# EAGLE design AGV (EAGLE 9.1.3)
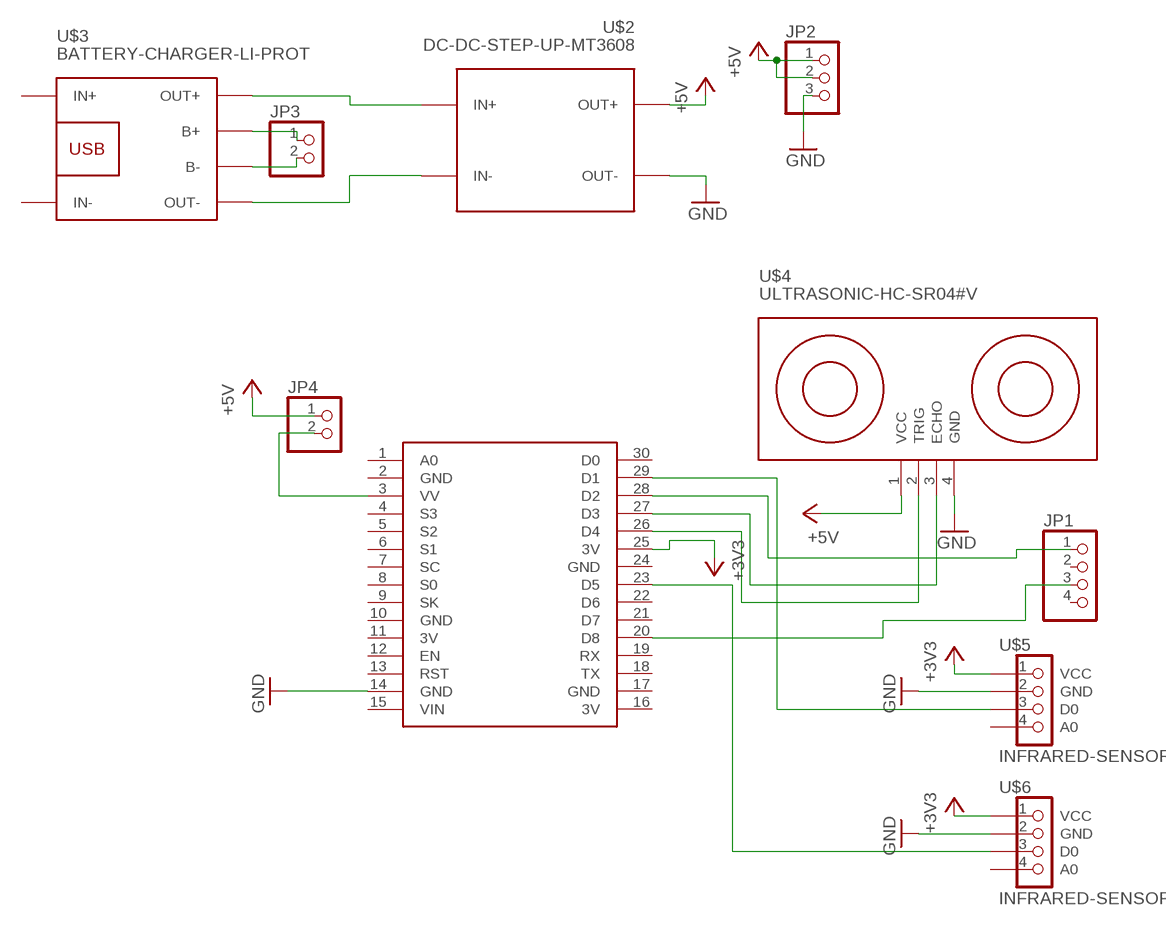
[diagram p0: schematic, sheet 1]

## Parts
JP1  PINHD-1X4  [1X04]
JP2  PINHD-1X3  [1X03]
JP3  PINHD-1X2  [1X02]
JP4  PINHD-1X2  [1X02]
U$1  NODEMCU  [NODEMCU]
U$2  DC-DC-STEP-UP-MT3608  [DC-DC-STEP-UP-MT3608]
U$3  BATTERY-CHARGER-LI-PROT  [BATTERY-CHARGER-LI-PROT]
U$4  ULTRASONIC-HC-SR04#V  [ULTRASONIC-HC-SR04#V]
U$5  INFRARED-SENSOR  [INFRARED-SENSOR]
U$6  INFRARED-SENSOR  [INFRARED-SENSOR]

## Nets
+3V3: U$1.25(3V) U$5.1(VCC) U$6.1(VCC)
+5V: JP2.1 JP2.2 JP4.1 U$2.OUT+ U$4.1(VCC)
GND: JP2.3 U$1.14(GND) U$2.OUT- U$4.4(GND) U$5.2(GND) U$6.2(GND)
N$1: JP3.1 U$3.B+
N$2: JP3.2 U$3.B-
N$3: U$2.IN+ U$3.OUT+
N$4: U$2.IN- U$3.OUT-
N$5: U$1.29(D1) U$5.3(D0)
N$6: JP1.1 U$1.28(D2)
N$7: U$1.27(D3) U$4.3(ECHO)
N$8: U$1.26(D4) U$4.2(TRIG)
N$9: JP4.2 U$1.3(VV)
N$10: U$1.23(D5) U$6.3(D0)
N$11: JP1.3 U$1.20(D8)
Unconnected: JP1.2 JP1.4 U$1.1(A0) U$1.4(S3) U$1.5(S2) U$1.6(S1) U$1.7(SC) U$1.8(S0) U$1.9(SK) U$1.12(EN) U$1.13(RST) U$1.15(VIN) U$1.18(TX) U$1.19(RX) U$1.21(D7) U$1.22(D6) U$1.30(D0) U$3.IN+ U$3.IN- U$5.4(A0) U$6.4(A0)

## Power pins joined to a net without a drawn wire
3V: U$1.11(3V) U$1.16(3V)
GND: U$1.2(GND) U$1.10(GND) U$1.17(GND) U$1.24(GND)

## Library data of the parts
JP1 = pinhead:PINHD-1X4: PIN HEADER
JP2 = pinhead:PINHD-1X3: PIN HEADER
JP3 JP4 = pinhead:PINHD-1X2: PIN HEADER
U$1 = MyLibrary:NODEMCU
U$2 = DIY Modules:DC-DC-STEP-UP-MT3608: DC/DC Step-Up Regulator based on MT3608 chip MT3608 datasheet available here: https://www.olimex.com/Products/Breadboarding/BB-PWR-3608/resources/MT3608.pdf Click here to find device on ebay.com <http://www.ebay.com/sch/mt3608+module>
U$3 = DIY Modules:BATTERY-CHARGER-LI-PROT: Lithium Battery 5V Charger with protection circuit More details available here: http://www.instructables.com/id/DIY-Lithium-ion-Battery-Charger/step4/TP4056-based-lithium-ion-battery-charger-module/ Click here to find device on ebay.com <http://www.ebay.com/sch/tp4056+charger+usb+protection>
U$4 = DIY Modules:ULTRASONIC-HC-SR04: Ultrasonic Ranging Module HC-SR04 More details available here: http://randomnerdtutorials.com/complete-guide-for-ultrasonic-sensor-hc-sr04/ Click here to find device on ebay.com <http://www.ebay.com/sch/hc+sr04+ultrasonic>
U$5 U$6 = MyLibrary:INFRARED-SENSOR

## Board
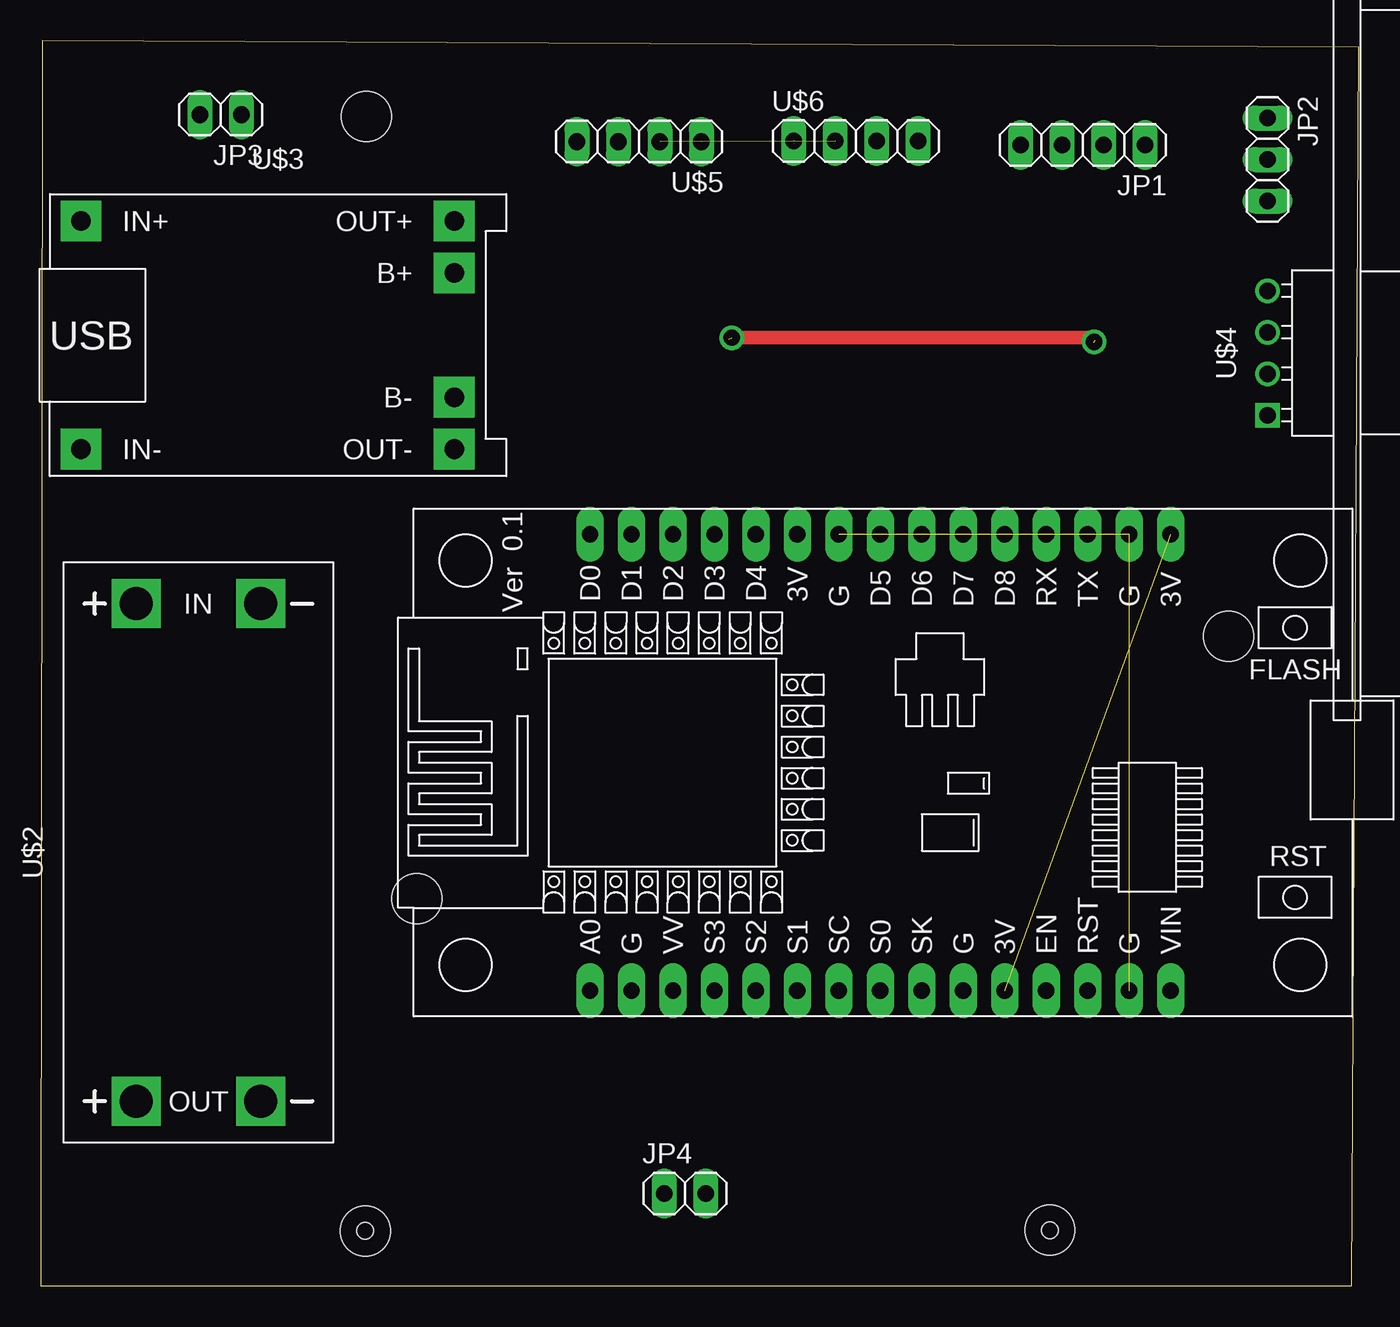
[diagram p1: board, top side]
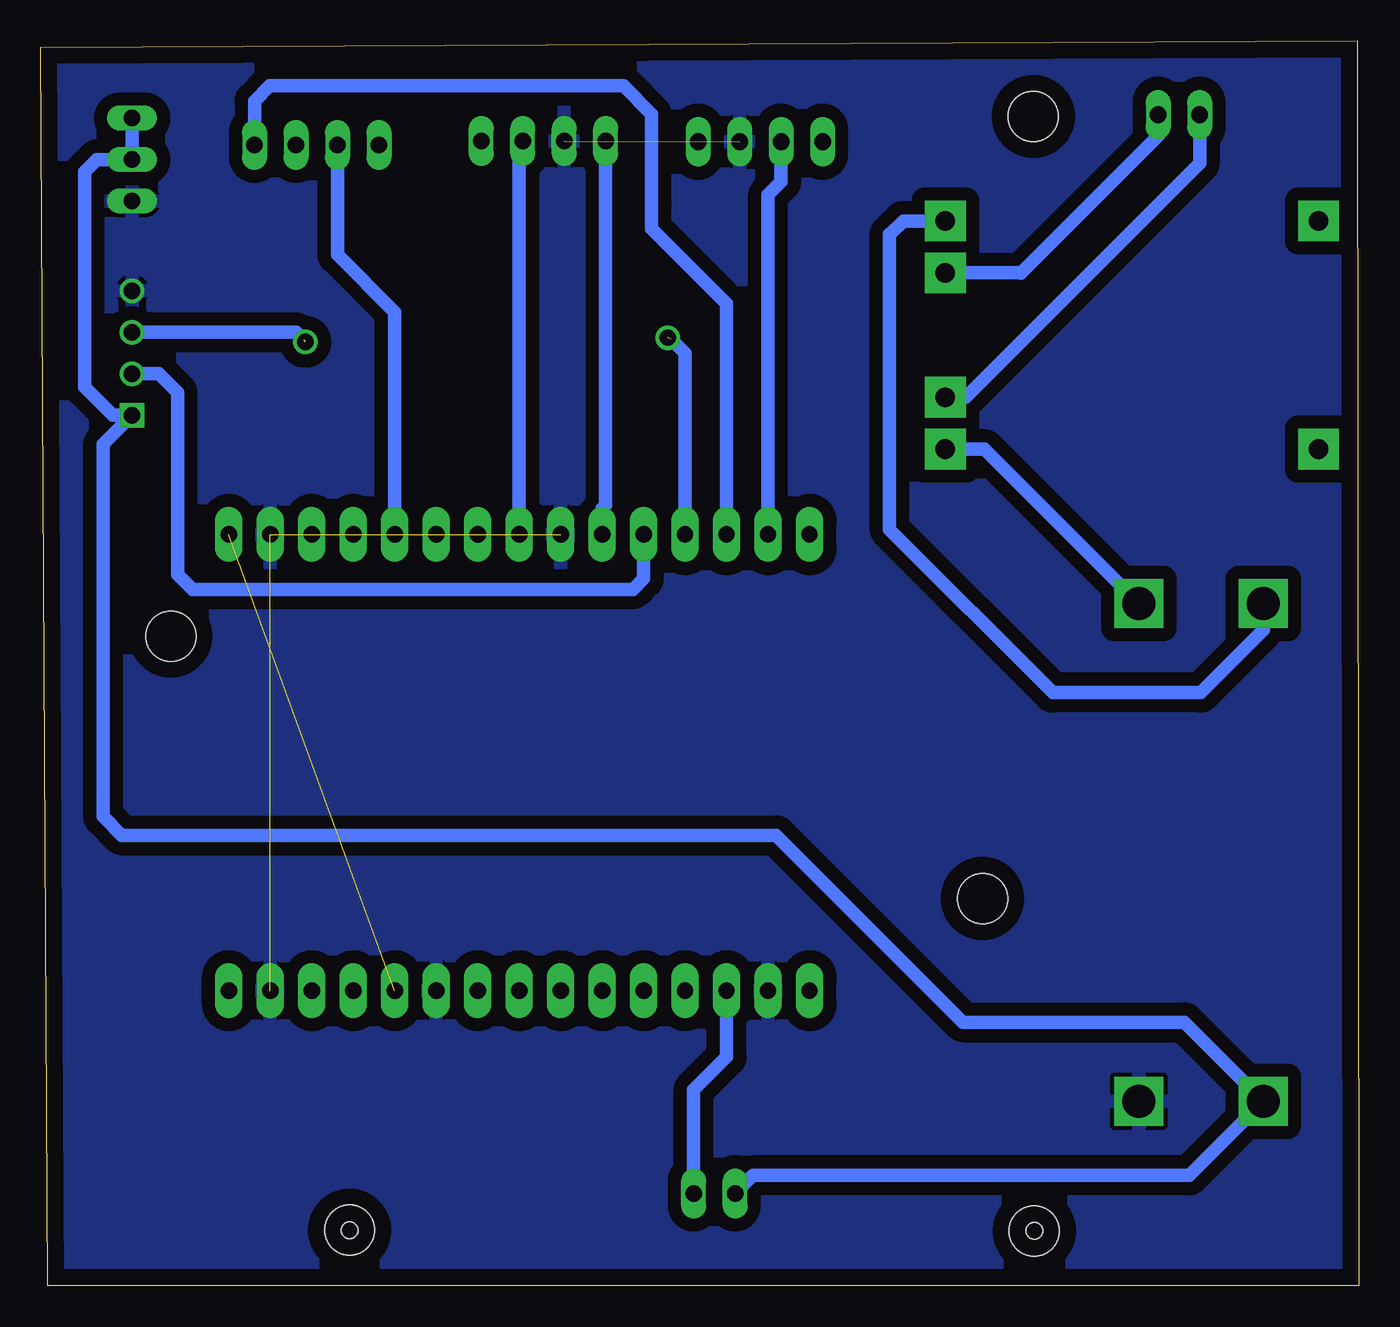
[diagram p2: board, bottom side, seen from below]

Size 80.7 x 76.25 mm. Coordinates in mm from the lower left corner, seen from the top.
Outline: 0,0 80.29,0.02 80.7,75.87 0.1,76.25 0,0
Copper layers (1*16): Top 0.035mm / dielectric 1.5mm / Bottom 0.035mm
Design rules "default": minimum track width 6mil, minimum drill 0.35mm, track to track 6mil, track to pad 6mil, pad to pad 6mil, via to via 6mil, smd to smd 6mil, copper to edge 40mil, drill to drill 6mil, minimum pad ring 10mil, minimum via ring 8mil, stop-mask expansion 4mil, vias tented up to drill 0mil, thermal gap 10mil
Holes 1 mm at 19.87,3.37 61.79,3.42
Holes 3.05 mm at 19.87,3.37 61.79,3.42 23.03,23.72 72.74,39.8 19.93,71.62

### Footprints (pad centres in the part's own frame; a part is rotated, then mirrored left to right if it is on the bottom)
1X04 = drill 1.016 long: 1 -3.81,0; 2 -1.27,0; 3 1.27,0; 4 3.81,0
1X03 = drill 1.016 long: 1 -2.54,0; 2 0,0; 3 2.54,0
1X02 = drill 1.016 long: 1 -1.27,0; 2 1.27,0
NODEMCU = drill 1 pad 1.676 long: 1 -13.97,19.05; 2 -13.97,16.51; 3 -13.97,13.97; 4 -13.97,11.43; 5 -13.97,8.89; 6 -13.97,6.35; 7 -13.97,3.81; 8 -13.97,1.27; 9 -13.97,-1.27; 10 -13.97,-3.81; 11 -13.97,-6.35; 12 -13.97,-8.89; 13 -13.97,-11.43; 14 -13.97,-13.97; 15 -13.97,-16.51; 16 13.97,-16.51; 17 13.97,-13.97; 18 13.97,-11.43; 19 13.97,-8.89; 20 13.97,-6.35; 21 13.97,-3.81; 22 13.97,-1.27; 23 13.97,1.27; 24 13.97,3.81; 25 13.97,6.35; 26 13.97,8.89; 27 13.97,11.43; 28 13.97,13.97; 29 13.97,16.51; 30 13.97,19.05
DC-DC-STEP-UP-MT3608 = drill 2 pad 2.8 square: IN+ 15.24,3.81; IN- 15.24,-3.81; OUT+ -15.24,3.81; OUT- -15.24,-3.81
BATTERY-CHARGER-LI-PROT = drill 1.2 pad 2.5 square: B+ 10.795,3.81; B- 10.795,-3.81; IN+ -12.065,6.985; IN- -12.065,-6.985; OUT+ 10.795,6.985; OUT- 10.795,-6.985
ULTRASONIC-HC-SR04#V = drill 1 square: 1 -3.81,0 | drill 1: 2 -1.27,0; 3 1.27,0; 4 3.81,0
INFRARED-SENSOR = drill 1.016 long: 1 -3.81,0; 2 -1.27,0; 3 1.27,0; 4 3.81,0

### Placement (x,y rotation side)
JP1  63.81,69.88 180 top
JP2  75.12,68.98 270 top
JP3  11,71.73 180 top
JP4  39.45,5.67 0 top
U$1  52.68,32.05 90 top
U$2  9.65,26.55 90 top
U$3  14.52,58.23 0 top
U$4  75.11,57.13 90 top
U$5  36.64,70.08 180 top
U$6  49.92,70.11 0 top

### Tracks (layer width: path | path; a pad name or v marks a point on that pad's centre or on a via)
3V  (1 unrouted)
+3V3  (1 unrouted)
  Bottom 0.813: U$1.25 46.33,47.6 46.11,47.82 U$6.1
+5V
  Bottom 0.813: JP2.1 JP2.2 77.27,68.98 78.02,68.23 78.02,55.04 76.3,53.32 U$4.1 76.89,51.55 76.89,28.74 75.74,27.59 35.67,27.59 24.23,16.15 10.68,16.15 U$2.OUT+ 10.38,6.77 37.08,6.77 JP4.1
GND  (3 unrouted)
  pour Bottom (isolate 0.813): -0.61,77.29 -0.32,77.57 83.06,77.57 83.06,-3.36 1.84,-3.36 -2.01,0.49 -2.01,75.84 -0.65,77.2 -0.79,77.34 -0.79,77.36 -0.76,77.38 -0.58,77.38
N$1
  Bottom 0.813: U$3.B+ 20.69,62.04 20.68,62.04 12.27,70.44 JP3.1
N$2
  Bottom 0.813: U$3.B- 24.07,54.42 9.73,68.75 JP3.2
N$3
  Bottom 0.813: U$3.OUT+ 27.88,65.22 28.7,64.4 28.73,64.4 28.73,46.34 18.74,36.34 9.68,36.34 5.84,40.18 U$2.IN+
N$4
  Bottom 0.813: U$2.IN- 22.92,51.25 U$3.OUT-
N$5
  Bottom 0.813: U$5.3 35.37,67.62 36.17,66.82 U$1.29
N$6
  Bottom 0.813: JP1.1 67.62,72.56 66.69,73.49 45.03,73.49 43.3,71.75 43.3,68.28 | 43.3,66.36 43.3,68.28 | U$1.28 38.71,60.15 43.3,64.74 43.3,68.28
N$7  (via drill 1)  (2 unrouted)
  Top 0.813: v42.31,58.07 64.24,58.07 v64.5,57.81
  Bottom 0.813: U$1.27 41.25,57.11 42.11,57.97 | 42.11,57.97 | U$4.3 65.08,58.4 64.58,57.91
N$8
  Bottom 0.813: U$4.2 73.48,55.86 72.33,54.71 72.33,43.58 71.78,43.03 71.41,42.66 44.44,42.66 43.79,43.31 U$1.26
N$9
  Bottom 0.813: JP4.2 40.72,12.01 38.71,14.02 U$1.3
N$10
  Bottom 0.813: U$1.23 51.41,69.89 U$6.3
N$11
  Bottom 0.813: JP1.3 62.54,63.15 59.03,59.64 U$1.20